# Altium schematic sheet Main.SchDoc
size 558 x 381 mm; SheetNumber: 1; SheetTotal: 1
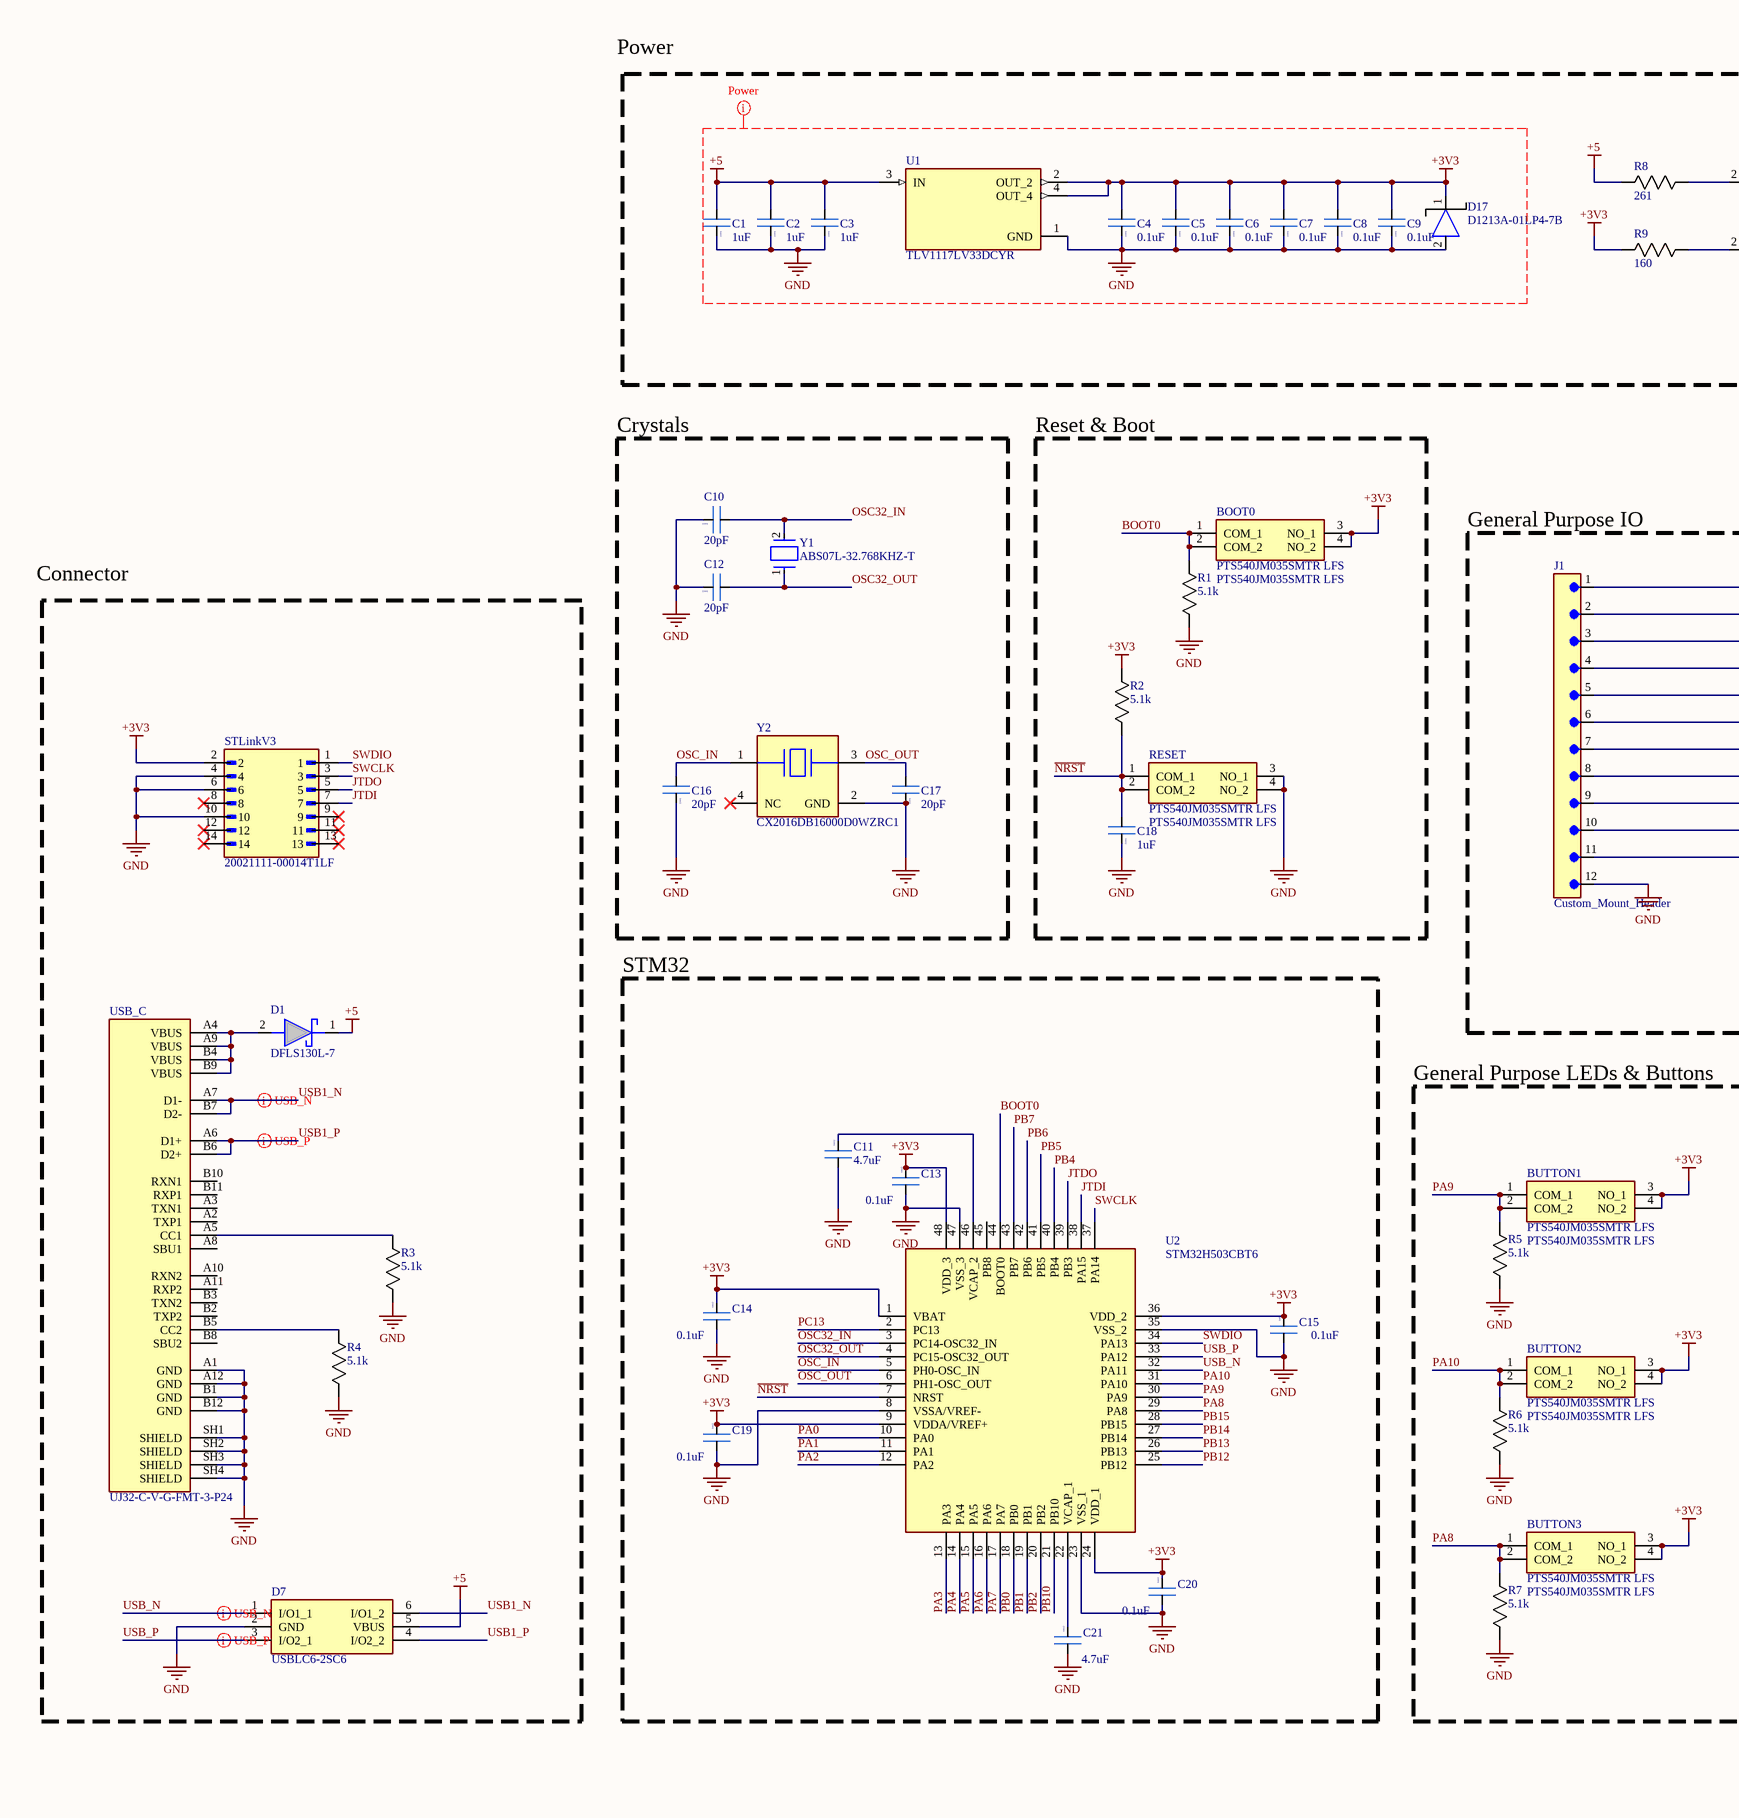
[diagram p0: Main.SchDoc, left]
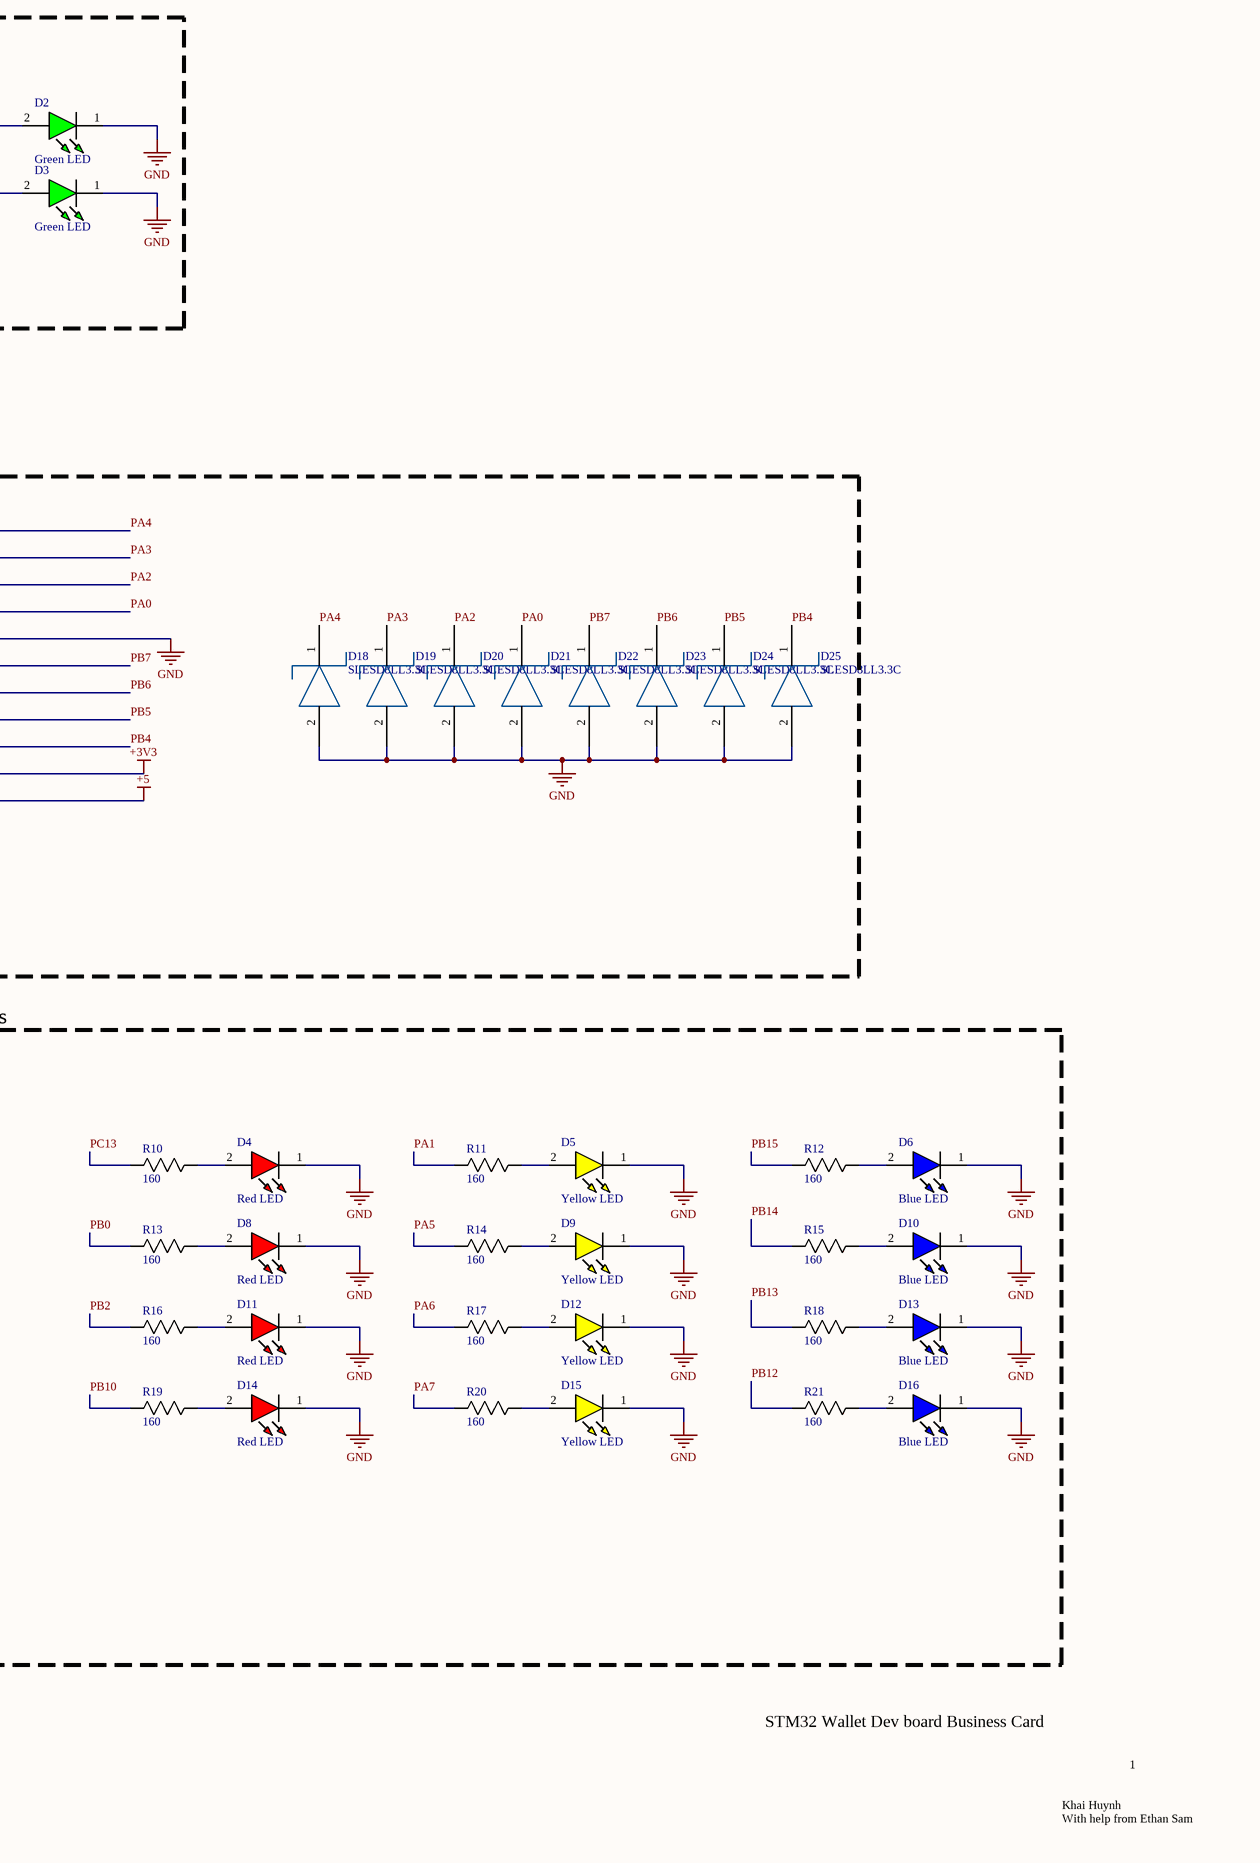
[diagram p1: Main.SchDoc, right]

## Parts
BOOT0  PTS540JM035SMTR LFS  [PTS540JM035SMTR LFS]
BUTTON1  PTS540JM035SMTR LFS  [PTS540JM035SMTR LFS]
BUTTON2  PTS540JM035SMTR LFS  [PTS540JM035SMTR LFS]
BUTTON3  PTS540JM035SMTR LFS  [PTS540JM035SMTR LFS]
C1  1uF  [0402 Capacitor]
C2  1uF  [0402 Capacitor]
C3  1uF  [0402 Capacitor]
C4  0.1uF  [0402 Capacitor]
C5  0.1uF  [0402 Capacitor]
C6  0.1uF  [0402 Capacitor]
C7  0.1uF  [0402 Capacitor]
C8  0.1uF  [0402 Capacitor]
C9  0.1uF  [0402 Capacitor]
C10  20pF  [0402 Capacitor]
C11  4.7uF  [0402 Capacitor]
C12  20pF  [0402 Capacitor]
C13  0.1uF  [0402 Capacitor]
C14  0.1uF  [0402 Capacitor]
C15  0.1uF  [0402 Capacitor]
C16  20pF  [0402 Capacitor]
C17  20pF  [0402 Capacitor]
C18  1uF  [0402 Capacitor]
C19  0.1uF  [0402 Capacitor]
C20  0.1uF  [0402 Capacitor]
C21  4.7uF  [0402 Capacitor]
D1  DFLS130L-7  [PCBComponent_1]
D2  Green LED  [0603 LED]
D3  Green LED  [0603 LED]
D4  Red LED  [0603 LED]
D5  Yellow LED  [0603 LED]
D6  Blue LED  [0603 LED]
D7  USBLC6-2SC6  [USBLC6-2SC6]
D8  Red LED  [0603 LED]
D9  Yellow LED  [0603 LED]
D10  Blue LED  [0603 LED]
D11  Red LED  [0603 LED]
D12  Yellow LED  [0603 LED]
D13  Blue LED  [0603 LED]
D14  Red LED  [0603 LED]
D15  Yellow LED  [0603 LED]
D16  Blue LED  [0603 LED]
D17  D1213A-01LP4-7B  [SLESD8LL3.3C]
D18  SLESD8LL3.3C  [SLESD8LL3.3C]
D19  SLESD8LL3.3C  [SLESD8LL3.3C]
D20  SLESD8LL3.3C  [SLESD8LL3.3C]
D21  SLESD8LL3.3C  [SLESD8LL3.3C]
D22  SLESD8LL3.3C  [SLESD8LL3.3C]
D23  SLESD8LL3.3C  [SLESD8LL3.3C]
D24  SLESD8LL3.3C  [SLESD8LL3.3C]
D25  SLESD8LL3.3C  [SLESD8LL3.3C]
J1  Custom_Mount_Header  [Custom_header]
R1  5.1k  [0402 Resistor]
R2  5.1k  [0402 Resistor]
R3  5.1k  [0402 Resistor]
R4  5.1k  [0402 Resistor]
R5  5.1k  [0402 Resistor]
R6  5.1k  [0402 Resistor]
R7  5.1k  [0402 Resistor]
R8  261  [0402 Resistor]
R9  160  [0402 Resistor]
R10  160  [0402 Resistor]
R11  160  [0402 Resistor]
R12  160  [0402 Resistor]
R13  160  [0402 Resistor]
R14  160  [0402 Resistor]
R15  160  [0402 Resistor]
R16  160  [0402 Resistor]
R17  160  [0402 Resistor]
R18  160  [0402 Resistor]
R19  160  [0402 Resistor]
R20  160  [0402 Resistor]
R21  160  [0402 Resistor]
RESET  PTS540JM035SMTR LFS  [PTS540JM035SMTR LFS]
STLinkV3  20021111-00014T1LF  [20021111-00014T1LF]
U1  TLV1117LV33DCYR  [TLV1117LV33DCYR]
U2  STM32H503CBT6  [STM32H503]
USB_C  UJ32-C-V-G-FMT-3-P24  [UJ32-C-V-G-FMT-3-P24]
Y1  ABS07L-32.768KHZ-T  [FP-ABS07L-MFG]
Y2  CX2016DB16000D0WZRC1  [CX2016DB16000D0WZRC1]

## Blocks framed on the sheet
Crystals: C10 C12 C16 C17 Y1 Y2
Reset & Boot: BOOT0 C18 R1 R2 RESET
General Purpose IO: D18-D25 J1
STM32: C11 C13-C15 C19-C21 U2
General Purpose LEDs & Buttons: BUTTON1-BUTTON3 D4-D6 D8-D16 R5-R7 R10-R21

## Nets
+3V3: BOOT0.3(NO_1) BOOT0.4(NO_2) BUTTON1.3(NO_1) BUTTON1.4(NO_2) BUTTON2.3(NO_1) BUTTON2.4(NO_2) BUTTON3.3(NO_1) BUTTON3.4(NO_2) C4.2 C5.2 C6.2 C7.2 C8.2 C9.2 C13.1 C14.1 C15.1 C19.1 C20.1 D17.1 J1.10 R2.1 R9.1 STLinkV3.2 U1.2(OUT_2) U1.4(OUT_4) U2.1(VBAT) U2.9(VDDA/VREF+) U2.24(VDD_1) U2.36(VDD_2) U2.48(VDD_3)
+5: C1.2 C2.2 C3.2 D1.1(K) D7.5(VBUS) J1.11 R8.1 U1.3(IN)
GND: C1.1 C2.1 C3.1 C4.1 C5.1 C6.1 C7.1 C8.1 C9.1 C10.1 C11.2 C12.1 C13.2 C14.2 C15.2 C16.1 C17.1 C18.1 C19.2 C20.2 C21.2 D2.1(K) D3.1(K) D4.1(K) D5.1(K) D6.1(K) D7.2(GND) D8.1(K) D9.1(K) D10.1(K) D11.1(K) D12.1(K) D13.1(K) D14.1(K) D15.1(K) D16.1(K) D17.2 D18.2 D19.2 D20.2 D21.2 D22.2 D23.2 D24.2 D25.2 J1.5 J1.12 R1.2 R3.2 R4.2 R5.2 R6.2 R7.2 RESET.3(NO_1) RESET.4(NO_2) STLinkV3.4 STLinkV3.6 STLinkV3.10 U1.1(GND) U2.8(VSSA/VREF-) U2.23(VSS_1) U2.35(VSS_2) U2.47(VSS_3) USB_C.A1(GND) USB_C.A12(GND) USB_C.B1(GND) USB_C.B12(GND) USB_C.SH1(SHIELD) USB_C.SH2(SHIELD) USB_C.SH3(SHIELD) USB_C.SH4(SHIELD) Y2.2(GND)
BOOT0: BOOT0.1(COM_1) BOOT0.2(COM_2) R1.1 U2.44(BOOT0)
JTDI: STLinkV3.7 U2.38(PA15)
JTDO: STLinkV3.5 U2.39(PB3)
~{NRST}: C18.2 R2.2 RESET.1(COM_1) RESET.2(COM_2) U2.7(NRST)
OSC32_IN: C10.2 U2.3(PC14-OSC32_IN) Y1.2
OSC32_OUT: C12.2 U2.4(PC15-OSC32_OUT) Y1.1
OSC_IN: C16.2 U2.5(PH0-OSC_IN) Y2.1
OSC_OUT: C17.2 U2.6(PH1-OSC_OUT) Y2.3
PA0: D21.1 J1.4 U2.10(PA0)
PA1: R11.1 U2.11(PA1)
PA2: D20.1 J1.3 U2.12(PA2)
PA3: D19.1 J1.2 U2.13(PA3)
PA4: D18.1 J1.1 U2.14(PA4)
PA5: R14.1 U2.15(PA5)
PA6: R17.1 U2.16(PA6)
PA7: R20.1 U2.17(PA7)
PA8: BUTTON3.1(COM_1) BUTTON3.2(COM_2) R7.1 U2.29(PA8)
PA9: BUTTON1.1(COM_1) BUTTON1.2(COM_2) R5.1 U2.30(PA9)
PA10: BUTTON2.1(COM_1) BUTTON2.2(COM_2) R6.1 U2.31(PA10)
PB0: R13.1 U2.18(PB0)
PB1: U2.19(PB1)
PB2: R16.1 U2.20(PB2)
PB4: D25.1 J1.9 U2.40(PB4)
PB5: D24.1 J1.8 U2.41(PB5)
PB6: D23.1 J1.7 U2.42(PB6)
PB7: D22.1 J1.6 U2.43(PB7)
PB10: R19.1 U2.21(PB10)
PB12: R21.1 U2.25(PB12)
PB13: R18.1 U2.26(PB13)
PB14: R15.1 U2.27(PB14)
PB15: R12.1 U2.28(PB15)
PC13: R10.1 U2.2(PC13)
SWCLK: STLinkV3.3 U2.37(PA14)
SWDIO: STLinkV3.1 U2.34(PA13)
USB1_N: D7.6(I/O1_2) USB_C.A7(D1-) USB_C.B7(D2-)
USB1_P: D7.4(I/O2_2) USB_C.A6(D1+) USB_C.B6(D2+)
USB_N: D7.1(I/O1_1) U2.32(PA11)
USB_P: D7.3(I/O2_1) U2.33(PA12)
NetC11_1: C11.1 U2.46(VCAP_2)
NetC21_1: C21.1 U2.22(VCAP_1)
NetD1_2: D1.2(A) USB_C.A4(VBUS) USB_C.A9(VBUS) USB_C.B4(VBUS) USB_C.B9(VBUS)
NetD2_2: D2.2(A) R8.2
NetD3_2: D3.2(A) R9.2
NetD4_2: D4.2(A) R10.2
NetD5_2: D5.2(A) R11.2
NetD6_2: D6.2(A) R12.2
NetD8_2: D8.2(A) R13.2
NetD9_2: D9.2(A) R14.2
NetD10_2: D10.2(A) R15.2
NetD11_2: D11.2(A) R16.2
NetD12_2: D12.2(A) R17.2
NetD13_2: D13.2(A) R18.2
NetD14_2: D14.2(A) R19.2
NetD15_2: D15.2(A) R20.2
NetD16_2: D16.2(A) R21.2
NetR3_1: R3.1 USB_C.A5(CC1)
NetR4_1: R4.1 USB_C.B5(CC2)

Not connected (* = marked no-connect by the designer): STLinkV3 8* 9* 11* 12* 13* 14*; U2 45(PB8); USB_C A2(TXP1) A3(TXN1) A8(SBU1) A10(RXN2) A11(RXP2) B2(TXP2) B3(TXN2) B8(SBU2) B10(RXN1) B11(RXP1); Y2 4(NC)*

## Layout directives
net class Power: +3V3, +5, GND
differential pair; differential pair class USB 90: USB1_N, USB1_P
differential pair; differential pair class USB1 90: USB_N, USB_P

## Notes on the sheet
- Power
- Connector
- STM32 Wallet Dev board Business Card
- 1
- Khai Huynh
- With help from Ethan Sam
- (in symbol 0402 Capacitor) 0402

## Library data of the parts
C1-C21 = 0402 Capacitor
D2 D3 = Green LED: APG1608CGKC/T; Supplier 1: DigiKey; Supplier Part Number 1: 754-1357-6-ND
D4 D8 D11 D14 = Red LED: APG1608SURKC/T; Supplier 1: DigiKey; Supplier Part Number 1: 754-1359-1-ND
D5 D9 D12 D15 = White LED: APG1608SYKC/T; Supplier 1: RS (Formerly Allied Electronics); Supplier Part Number 1: APG1608SYKC/T
D6 D10 D13 D16 = Blue LED: APG1608QBC/D; Supplier 1: RS (Formerly Allied Electronics); Supplier Part Number 1: APG1608QBC/D
R1-R21 = 0402 Resistor
Y1 = CMP-27762-003010-1: CRYSTAL 32.7680KHZ 12.5PF SMD; Series Resistance: 55kR; Tolerance: 20ppm; Max Operating Temperature: 85°C; Min Operating Temperature: -40°C; Series: ABS07L; Package Quantity: 1; Lead Free: Lead Free; Load Capacitance: 12.5pF; Packaging: Tape and Reel; Frequency: 32.768kHz; Height: 0.015inch; Number of Pins: 2; Length: 0.126inch; Width: 0.059inch; Termination: SMD/SMT; RoHS Compliant: Yes; Mount: Surface Mount; Radiation Hardening: No; Case/Package: SMD/SMT; ESR (Equivalent Series Resistance): 55kR; Frequency Tolerance: 20ppm
BOOT0 BUTTON1-BUTTON3 RESET = PTS540JM035SMTR LFS: Supplier 1: DigiKey; Supplier Part Number 1: CKN10809CT-ND
D1 = DFLS130L-7: Supplier 1: Avnet; Supplier Part Number 1: DFLS130L-7
D7 = USBLC6-2SC6: Supplier 1: Avnet; Supplier Part Number 1: USBLC6-2SC6
D17 = D1213A-01LP4-7B: Supplier 1: Newark; Supplier Part Number 1: D1213A-01LP4-7B
U1 = TLV1117LV33DCYR: Supplier 1: DigiKey; Supplier Part Number 1: 296-28778-1-ND
U2 = STM32H503CBT6: Supplier 1: Arrow Electronics; Supplier Part Number 1: STM32H503CBT6
USB_C = UJ32-C-V-G-FMT-3-P24: Supplier 1: DigiKey; Supplier Part Number 1: 2223-UJ32-C-V-G-FMT-3-P24-ND
Y2 = CX2016DB16000D0WZRC1: Supplier 1: DigiKey; Supplier Part Number 1: 478-CX2016DB16000D0WZRC1CT-ND